# EAGLE design Stratologger sl100 Board (EAGLE 8.7.1)
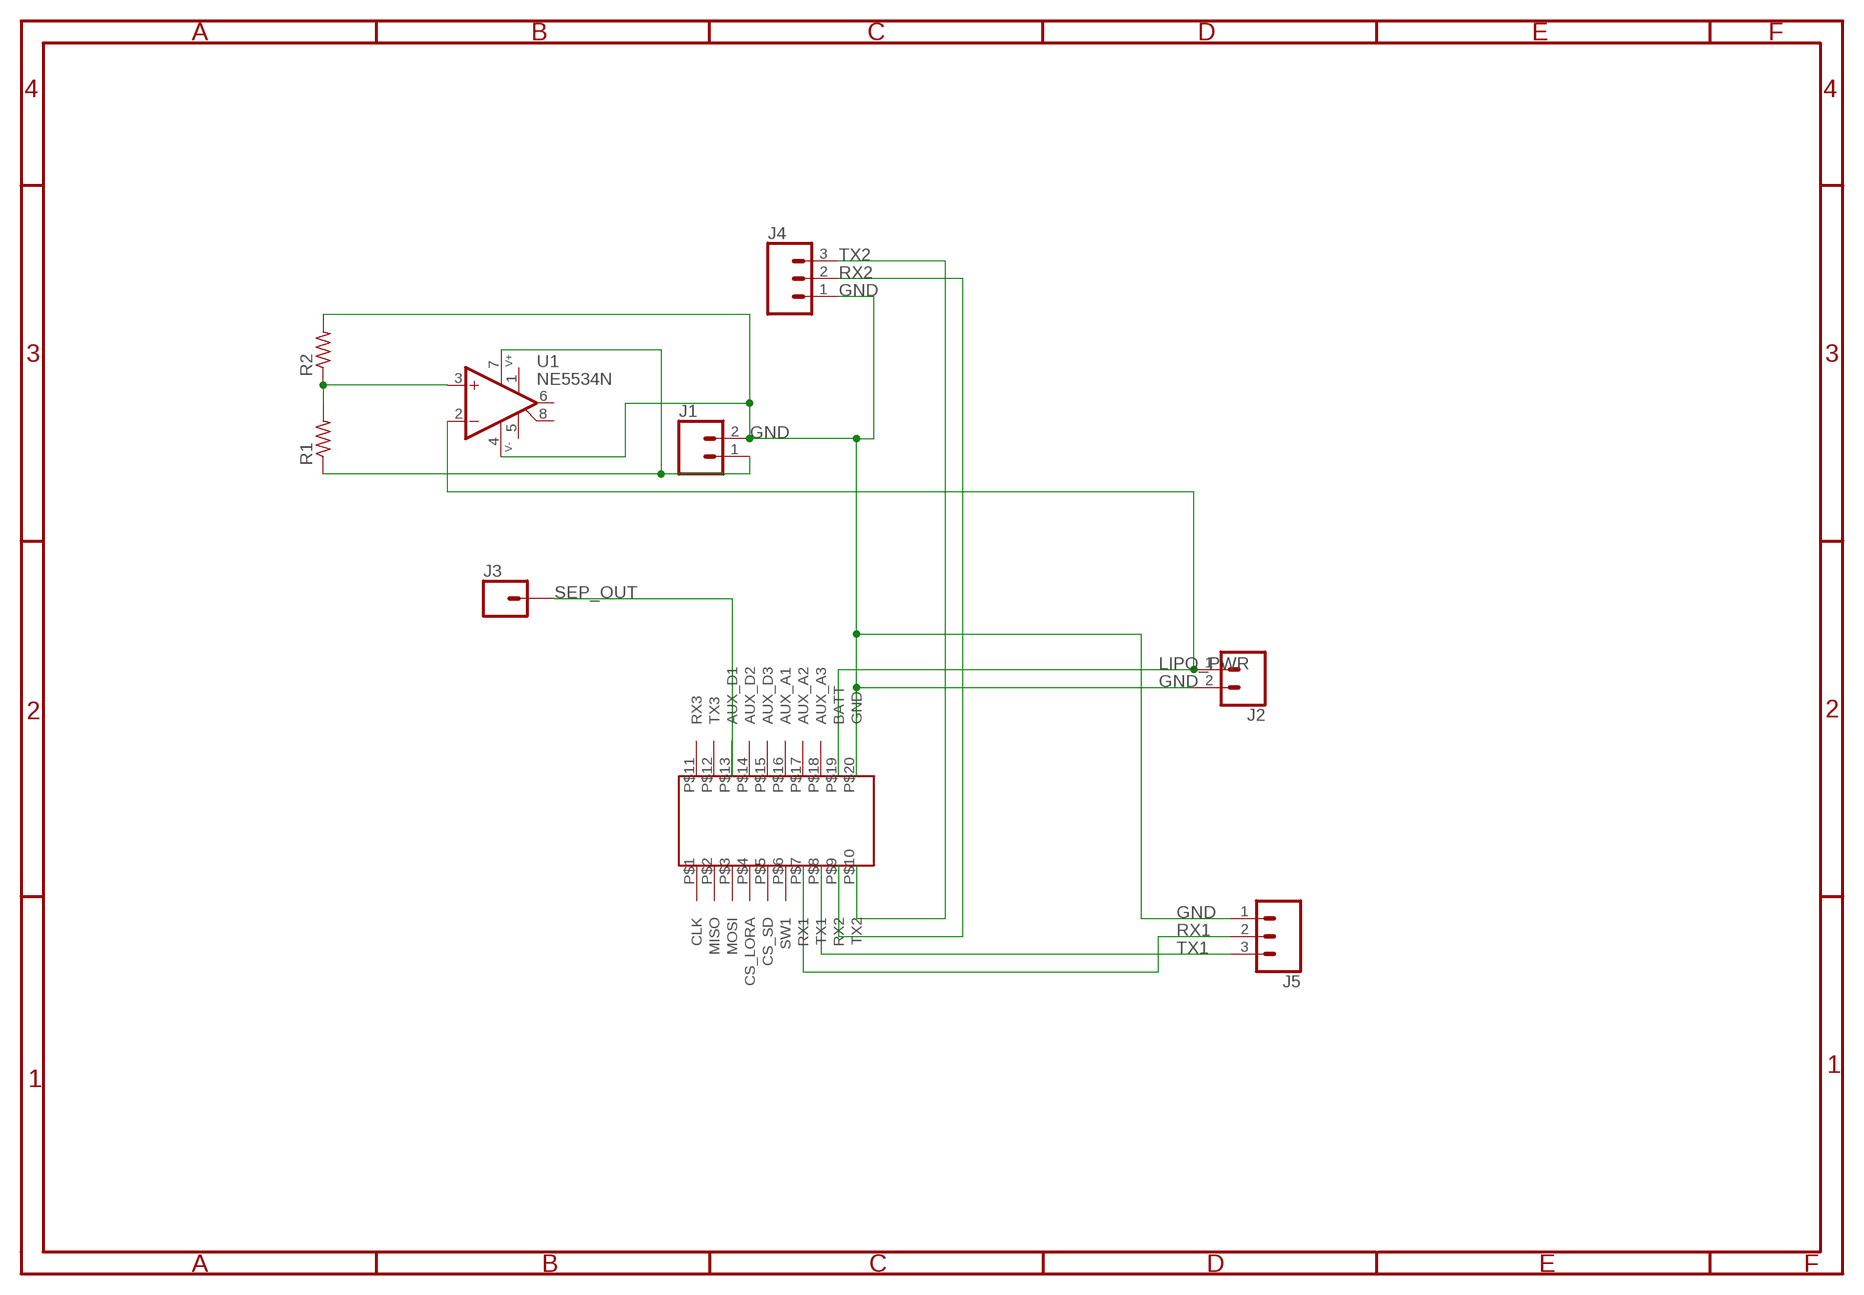
[diagram p0: schematic, sheet 1]

## Parts
J1  CONN_02  [1X02]
J2  CONN_02  [1X02]
J3  CONN_01  [1X01]
J4  CONN_03  [1X03]
J5  CONN_03  [1X03]
R1  R-US_0207/12  [0207/12]
R2  R-US_0207/12  [0207/12]
U1  NE5534N  [DIL08]
U$2  STRATOLOGGER  [STRATOLOGGER]
U$3  SMALLHEADERPACKAGE  [SMALLHEADERPACKAGE]

## Nets
GND: J1.2 J2.2 J4.1 J5.1 R2.2 U1.4(P:V-) U$3.P$20(GND)
LIPO_PWR: J2.1 U1.2(A:-IN) U$3.P$19(BATT)
N$1: J1.1 R1.1 U1.7(P:V+)
N$2: R1.2 R2.1 U1.3(A:+IN)
RX1: J5.2 U$3.P$7(RX1)
RX2: J4.2 U$3.P$9(RX2)
SEP_OUT: J3.1 U$3.P$13(AUX_D1)
TX1: J5.3 U$3.P$8(TX1)
TX2: J4.3 U$3.P$10(TX2)
Unconnected: U1.1(-BAL:BAL) U1.5(-BALCOMP:CMP) U1.6(A:OUT) U1.8(-BALCOMP:BAL/CMP) U$3.P$1(CLK) U$3.P$2(MISO) U$3.P$3(MOSI) U$3.P$4(CS_LORA) U$3.P$5(CS_SD) U$3.P$6(SW1) U$3.P$11(RX3) U$3.P$12(TX3) U$3.P$14(AUX_D2) U$3.P$15(AUX_D3) U$3.P$16(AUX_A1) U$3.P$17(AUX_A2) U$3.P$18(AUX_A3)

## Library data of the parts
J1 J2 = SparkFun-Connectors:CONN_02: Multi connection point. Often used as Generic Header-pin footprint for 0.1 inch spaced/style header connections On any of the 0.1 inch spaced packages, you can populate with these: Break Away Headers - Straight <https://www.sparkfun.com/products/116> (PRT-00116) Break Away Male Headers - Right Angle <https://www.sparkfun.com/products/553> (PRT-00553) Female Headers <https://www.sparkfun.com/products/115> (PRT-00115) Break Away Headers - Machine Pin <https://www.sparkfun.com/products/117> (PRT-00117) Break Away Female Headers - Swiss Machine Pin <https://www.sparkfun.com/products/743> (PRT-00743) For SCREWTERMINALS and SPRING TERMINALS visit here: Screw Terimnals on SparkFun.com <https://www.sparkfun.com/search/results?term=Screw+Terminals> (5mm/3.5mm/2.54mm spacing) This device is also useful as a general connection point to wire up your design to another part of your project. Our various solder wires solder well into these plated through hole pads. Hook-Up Wire - Assortment (Stranded, 22 AWG) <https://www.sparkfun.com/products/11375> (PRT-11375) Hook-Up Wire - Assortment (Solid Core, 22 AWG) <https://www.sparkfun.com/products/11367> (PRT-11367) View the entire wire category on our website here <https://www.sparkfun.com/categories/141> Special notes: Molex polarized connector foot print use with: PRT-08233 with associated crimp pins and housings. 2.54_SCREWTERM for use with PRT-10571. 3.5mm Screw Terminal footprints for PRT-08084 5mm Screw Terminal footprints for use with PRT-08432
J3 = SparkFun-Connectors:CONN_01: Single connection point. Often used as Generic Header-pin footprint for 0.1 inch spaced/style header connections On any of the 0.1 inch spaced packages, you can populate with these: Break Away Headers - Straight <https://www.sparkfun.com/products/116> (PRT-00116) Break Away Male Headers - Right Angle <https://www.sparkfun.com/products/553> (PRT-00553) Female Headers <https://www.sparkfun.com/products/115> (PRT-00115) Break Away Headers - Machine Pin <https://www.sparkfun.com/products/117> (PRT-00117) Break Away Female Headers - Swiss Machine Pin <https://www.sparkfun.com/products/743> (PRT-00743) This device is also useful as a general connection point to wire up your design to another part of your project. Our various solder wires solder well into these plated through hole pads. Hook-Up Wire - Assortment (Stranded, 22 AWG) <https://www.sparkfun.com/products/11375> (PRT-11375) Hook-Up Wire - Assortment (Solid Core, 22 AWG) <https://www.sparkfun.com/products/11367> (PRT-11367) View the entire wire category on our website here <https://www.sparkfun.com/categories/141> Special notes: SMTSO-256-ET is a "flush mount" nut for a 4-40 screw. We mostly use this on specialty testbeds; it is a nice way to connect hardware to your PCB at an adjustable hieght. Also note, the SNAP packages are for using a snappable style connector. We sell a baggie of snaps and they are also used on two LilyPad designs: Snap Assortment - 30 pack (male and female) <https://www.sparkfun.com/products/11347> (DEV-11347) LilyPad Arduino SimpleSnap <https://www.sparkfun.com/products/10941> (DEV-10941) LilyPad SimpleSnap Protoboard <https://www.sparkfun.com/products/10940> (DEV-10940)
J4 J5 = SparkFun-Connectors:CONN_03: Multi connection point. Often used as Generic Header-pin footprint for 0.1 inch spaced/style header connections On any of the 0.1 inch spaced packages, you can populate with these: Break Away Headers - Straight <https://www.sparkfun.com/products/116> (PRT-00116) Break Away Male Headers - Right Angle <https://www.sparkfun.com/products/553> (PRT-00553) Female Headers <https://www.sparkfun.com/products/115> (PRT-00115) Break Away Headers - Machine Pin <https://www.sparkfun.com/products/117> (PRT-00117) Break Away Female Headers - Swiss Machine Pin <https://www.sparkfun.com/products/743> (PRT-00743) Stackable Header - 3 Pin (Female, 0.1") <https://www.sparkfun.com/products/13875> (PRT-13875) For SCREWTERMINALS and SPRING TERMINALS visit here: Screw Terimnals on SparkFun.com <https://www.sparkfun.com/search/results?term=Screw+Terminals> (5mm/3.5mm/2.54mm spacing) This device is also useful as a general connection point to wire up your design to another part of your project. Our various solder wires solder well into these plated through hole pads. Hook-Up Wire - Assortment (Stranded, 22 AWG) <https://www.sparkfun.com/products/11375> (PRT-11375) Hook-Up Wire - Assortment (Solid Core, 22 AWG) <https://www.sparkfun.com/products/11367> (PRT-11367) View the entire wire category on our website here <https://www.sparkfun.com/categories/141> Special notes: Molex polarized connector foot print use with SKU : PRT-08232 with associated crimp pins and housings.
R1 R2 = adafruit:R-US_: RESISTOR, American symbol
U1 = op-amp:NE5534: OP-AMP
U$2 = LRA_FlightCPU_Components:STRATOLOGGER
U$3 = LRA_FlightCPU_Connector:SMALLHEADERPACKAGE

## Board
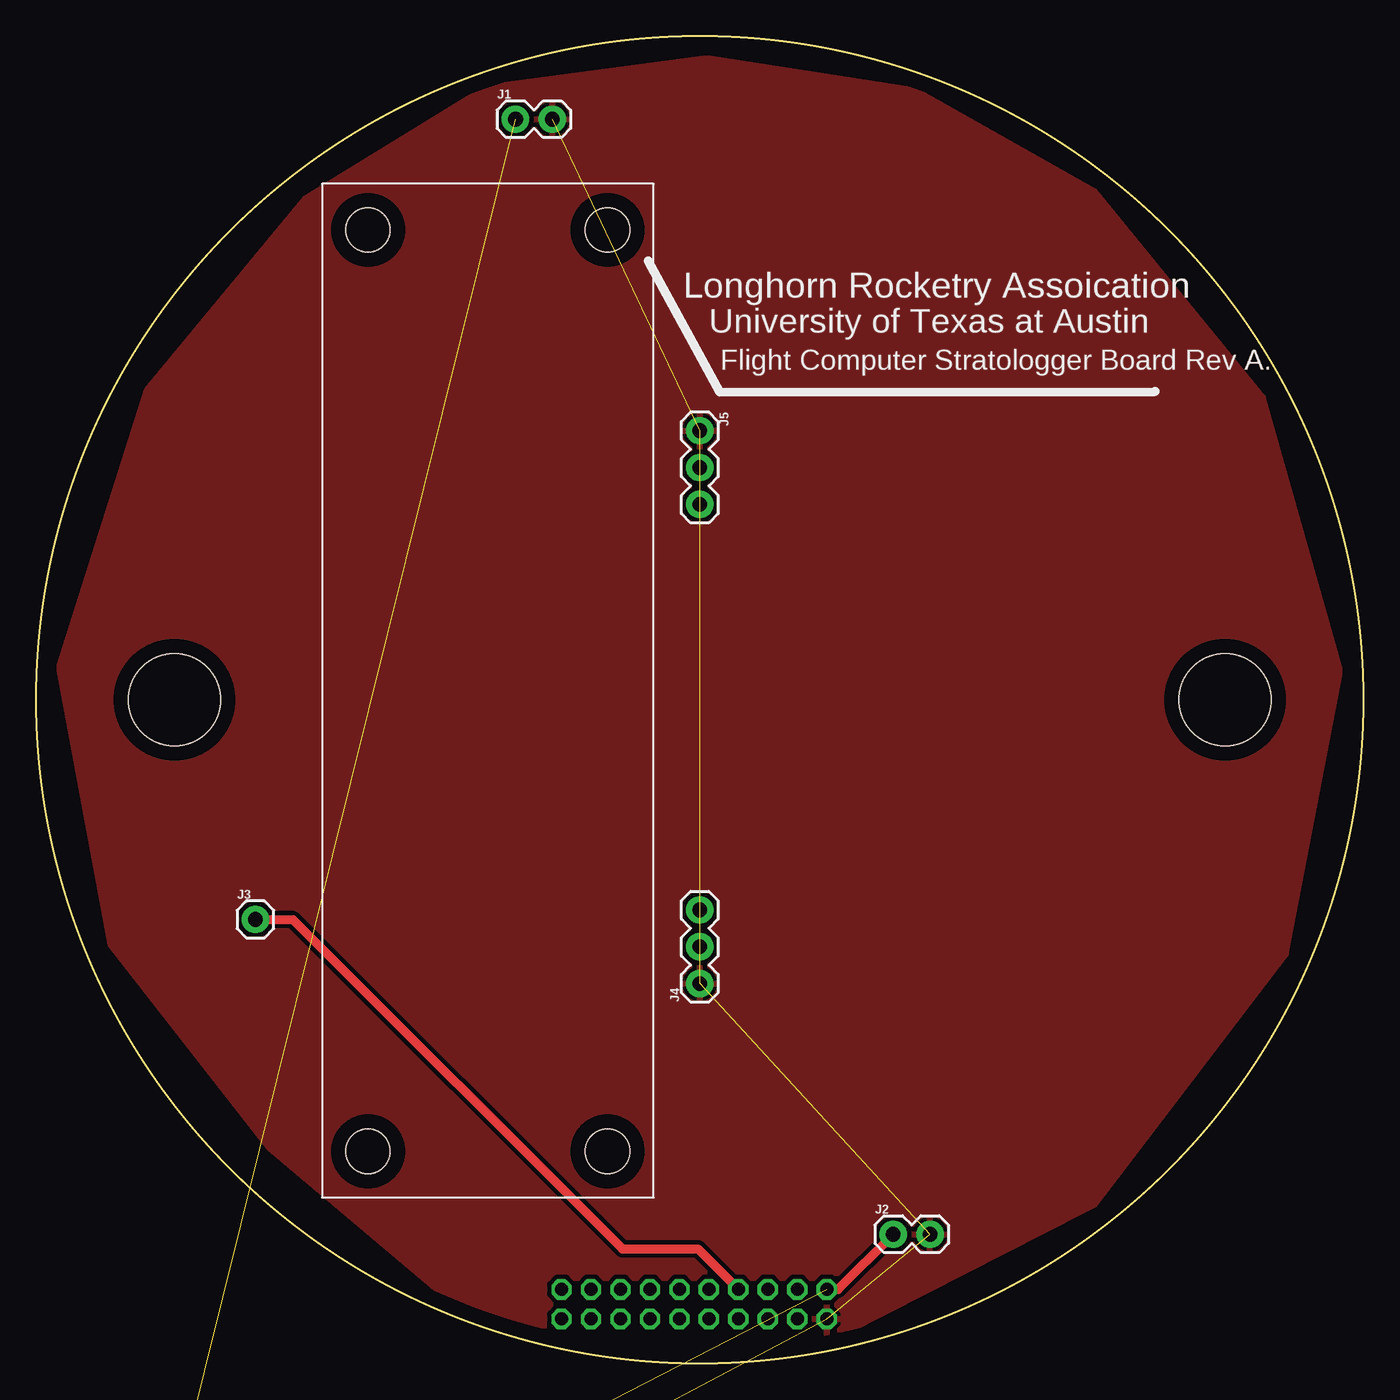
[diagram p1: board, top side]
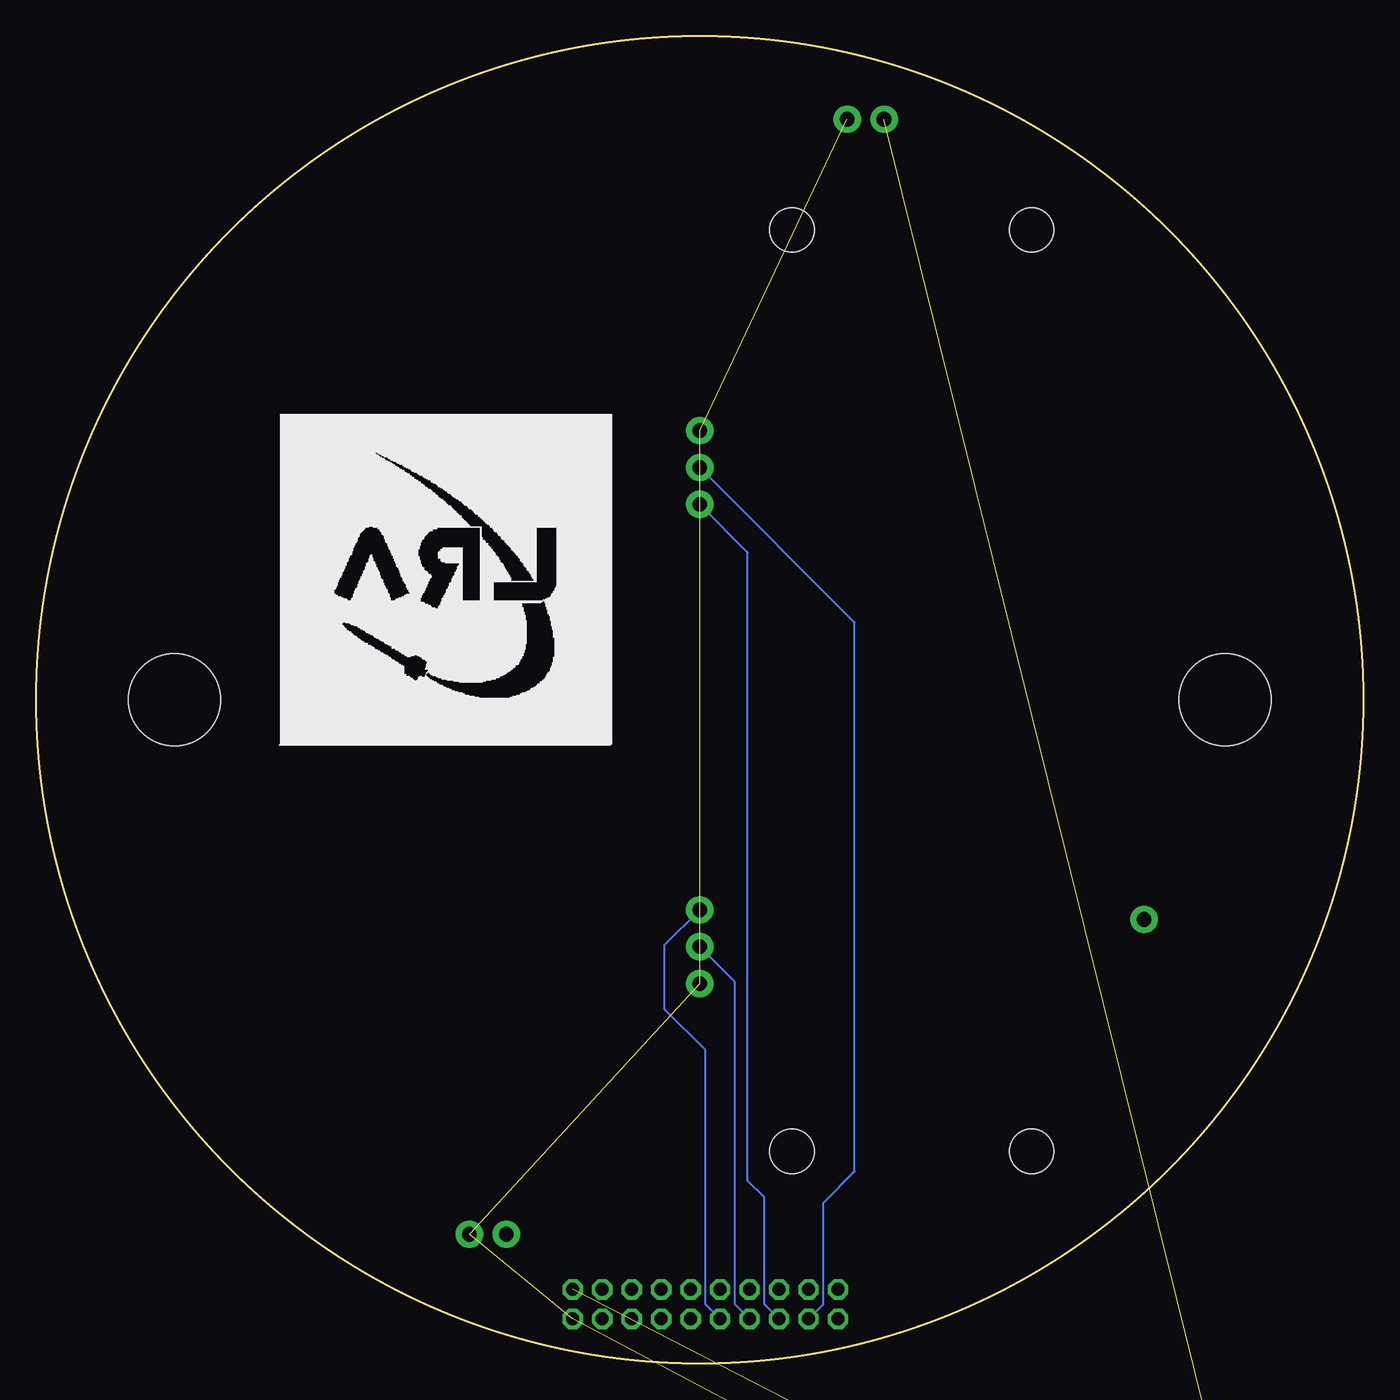
[diagram p2: board, bottom side, seen from below]

Size 91.44 x 91.44 mm. Coordinates in mm from the lower left corner, seen from the top.
Outline: circle at 45.72,45.72 radius 45.72
Copper layers (1*16): Top 0.035mm / dielectric 1.5mm / Bottom 0.035mm
Design rules "default *": minimum track width 0.15mm, minimum drill 0.35mm, track to track 12mil, track to pad 6mil, pad to pad 6mil, via to via 6mil, smd to smd 6mil, copper to edge 40mil, drill to drill 6mil, minimum pad ring 10mil, minimum via ring 8mil, stop-mask expansion 4mil, vias tented up to drill 0mil, thermal gap 10mil
Holes 6.35 mm at 9.53,45.72 81.92,45.72

### Footprints (pad centres in the part's own frame; a part is rotated, then mirrored left to right if it is on the bottom)
1X02 = drill 1.016 pad 1.88: 1 0,0; 2 2.54,0
1X01 = drill 1.016 pad 1.88: 1 0,0
1X03 = drill 1.016 pad 1.88: 1 0,0; 2 2.54,0; 3 5.08,0
0207/12 = drill 0.813 pad 1.676 octagon: 1 -6.35,0; 2 6.35,0
DIL08 = drill 0.813 long: 1 -3.81,-3.81; 2 -1.27,-3.81; 3 1.27,-3.81; 4 3.81,-3.81; 5 3.81,3.81; 6 1.27,3.81; 7 -1.27,3.81; 8 -3.81,3.81
STRATOLOGGER = hole 3.048: -3.175,3.175; -3.175,19.685; -66.675,19.685; -66.675,3.175
SMALLHEADERPACKAGE = drill 0.9 octagon: P$1 0,0; P$2 0,2.032; P$3 0,4.064; P$4 0,6.096; P$5 0,8.128; P$6 2.032,0; P$7 2.032,2.032; P$8 2.032,4.064; P$9 2.032,6.096; P$10 2.032,8.128; P$11 2.032,10.16; P$12 0,10.16; P$13 0,12.192; P$14 2.032,12.192; P$15 0,14.224; P$16 2.032,14.224; P$17 2.032,16.256; P$18 0,16.256; P$19 0,18.288; P$20 2.032,18.288

### Placement (x,y rotation side)
J1  33.02,85.72 0 top
J2  59.05,8.89 0 top
J3  15.1,30.58 0 top
J4  45.72,26.16 90 top
J5  45.72,64.26 270 top
R1  14.71,-33.3 0 top  (outside the outline)
R2  14.71,-50.06 0 top  (outside the outline)
U1  10.36,-14.48 0 top  (outside the outline)
U$2  19.68,11.43 270 top
U$3  36.2,5.08 270 top

### Tracks (layer width: path | path; a pad name or v marks a point on that pad's centre or on a via)
GND  (6 unrouted)
  pour Top: 45.47,1.27 55.12,1.78 72.9,10.92 86.11,28.19 89.87,47.7 84.53,66.55 72.9,80.77 60.66,87.68 46.23,89.92 30.99,87.88 18.54,80.26 7.62,67.06 1.55,47.96 5.11,28.85 16.05,14.86 27.48,5.21 36.32,1.52
LIPO_PWR  (1 unrouted)
  Top 0.61: U$3.P$19 55.24,5.08 J2.1
N$1  (2 unrouted)
N$2  (2 unrouted)
RX1
  Bottom 0.127: U$3.P$7 37.21,4.06 37.21,11.05 35.05,13.21 35.05,51.05 J5.2
RX2
  Bottom 0.127: U$3.P$9 43.31,4.06 43.31,26.29 J4.2
SEP_OUT
  Top 0.61: J3.1 17.68,30.58 40.39,7.87 45.59,7.87 U$3.P$13
TX1
  Bottom 0.127: U$3.P$8 41.27,4.06 41.27,11.43 42.42,12.57 42.42,55.88 J5.3
TX2
  Bottom 0.127: U$3.P$10 45.34,4.06 45.34,21.59 48.13,24.38 48.13,28.83 J4.3

### Text on the board
tPlace: Longhorn Rocketry Assoication | University of Texas at Austin | Flight Computer Stratologger Board Rev A.